# Altium schematic sheet 403mainschematic.SchDoc
size A; SheetNumber: 7; SheetTotal: 15
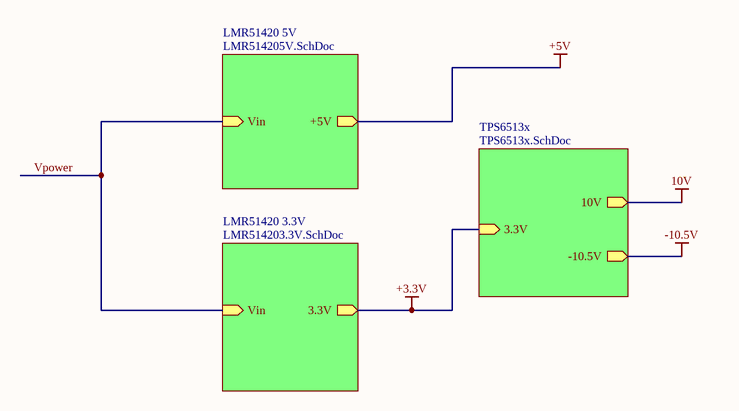
[diagram p0: 403mainschematic.SchDoc]

## Sub-sheets
LMR51420 3.3V = LMR514203.3V.SchDoc: Vin (in), 3.3V (out)
LMR51420 5V = LMR514205V.SchDoc: Vin (in), +5V (out)
TPS6513x = TPS6513x.SchDoc: 3.3V (in), 10V (out), -10.5V (out)

## Nets
10V: sheet TPS6513x/10V
+3.3V: sheet LMR51420 3.3V/3.3V, sheet TPS6513x/3.3V
+5V: sheet LMR51420 5V/+5V
-10.5V: sheet TPS6513x/-10.5V
Vpower: sheet LMR51420 3.3V/Vin, sheet LMR51420 5V/Vin